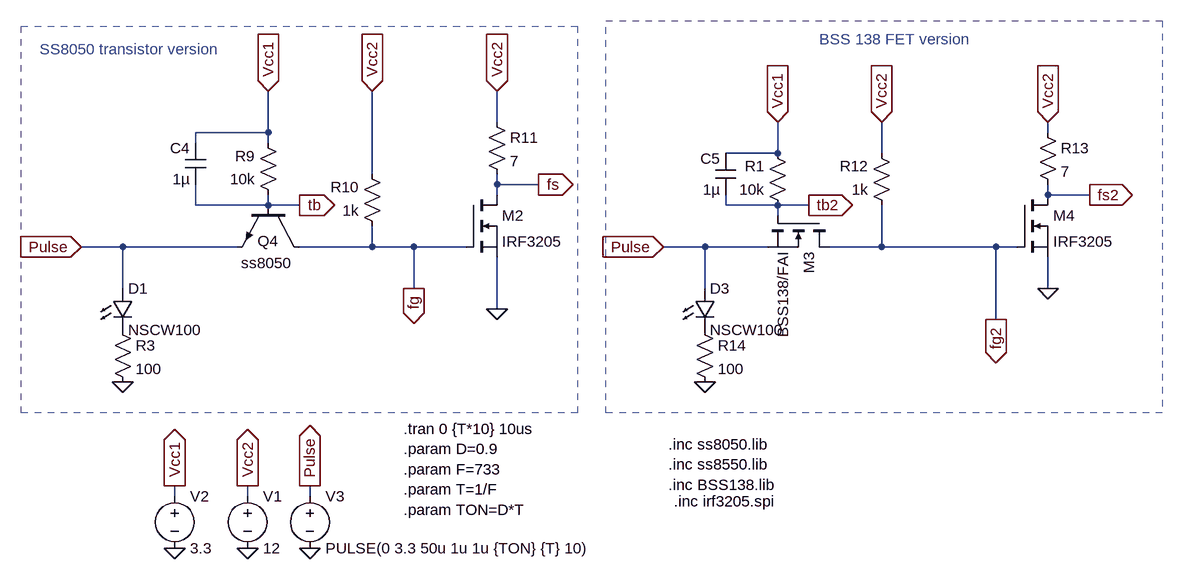
[diagram p0: schematic Tire Warmer.asc]
Tire Warmer.asc, the LTspice schematic file:
Version 4
SHEET 1 1844 824
WIRE 656 48 656 0
WIRE 304 64 304 0
WIRE 304 64 192 64
WIRE 1504 64 1504 48
WIRE 192 80 192 64
WIRE 304 80 304 64
WIRE 1088 96 1088 48
WIRE 1088 96 1008 96
WIRE 1248 96 1248 48
WIRE 464 128 464 0
WIRE 656 144 656 128
WIRE 720 144 656 144
WIRE 656 160 656 144
WIRE 1504 160 1504 144
WIRE 1568 160 1504 160
WIRE 192 176 192 144
WIRE 304 176 304 160
WIRE 304 176 192 176
WIRE 352 176 304 176
WIRE 1008 176 1008 160
WIRE 1088 176 1008 176
WIRE 1136 176 1088 176
WIRE 1088 192 1088 176
WIRE 80 240 16 240
WIRE 256 240 80 240
WIRE 464 240 464 208
WIRE 464 240 352 240
WIRE 528 240 464 240
WIRE 608 240 528 240
WIRE 976 240 912 240
WIRE 1072 240 976 240
WIRE 1248 240 1248 176
WIRE 1248 240 1168 240
WIRE 1424 240 1248 240
WIRE 1456 240 1424 240
WIRE 80 304 80 240
WIRE 528 304 528 240
WIRE 976 304 976 240
WIRE 1504 304 1504 256
WIRE 656 336 656 256
WIRE 1424 352 1424 240
WIRE 160 624 160 608
WIRE 272 624 272 608
WIRE 368 624 368 608
FLAG 272 704 0
FLAG 160 704 0
FLAG 272 608 Vcc2
IOPIN 272 608 Out
FLAG 160 608 Vcc1
IOPIN 160 608 Out
FLAG 368 608 Pulse
IOPIN 368 608 Out
FLAG 16 240 Pulse
IOPIN 16 240 In
FLAG 368 704 0
FLAG 304 0 Vcc1
IOPIN 304 0 In
FLAG 464 0 Vcc2
IOPIN 464 0 In
FLAG 656 0 Vcc2
IOPIN 656 0 In
FLAG 720 144 fs
IOPIN 720 144 Out
FLAG 656 336 0
FLAG 528 304 fg
IOPIN 528 304 Out
FLAG 1088 48 Vcc1
IOPIN 1088 48 In
FLAG 1248 48 Vcc2
IOPIN 1248 48 In
FLAG 1424 352 fg2
IOPIN 1424 352 Out
FLAG 1504 48 Vcc2
IOPIN 1504 48 In
FLAG 1504 304 0
FLAG 1568 160 fs2
IOPIN 1568 160 Out
FLAG 352 176 tb
IOPIN 352 176 Out
FLAG 80 448 0
FLAG 912 240 Pulse
IOPIN 912 240 In
FLAG 976 448 0
FLAG 1136 176 tb2
IOPIN 1136 176 Out
SYMBOL voltage 272 608 R0
SYMATTR InstName V1
SYMATTR Value 12
SYMBOL voltage 160 608 R0
SYMATTR InstName V2
SYMATTR Value 3.3
SYMBOL voltage 368 608 R0
SYMATTR InstName V3
SYMATTR Value PULSE(0 3.3 50u 1u 1u {TON} {T} 10)
SYMBOL LED 64 304 R0
SYMATTR InstName D1
SYMATTR Value NSCW100
SYMBOL res 64 352 R0
SYMATTR InstName R3
SYMATTR Value 100
SYMBOL npn 352 176 R90
WINDOW 0 55 32 VRight 2
WINDOW 3 89 12 VRight 2
SYMATTR InstName Q4
SYMATTR Value ss8050
SYMBOL res 320 176 R180
WINDOW 0 36 76 Left 2
WINDOW 3 36 40 Left 2
SYMATTR InstName R9
SYMATTR Value 10k
SYMBOL res 480 224 R180
WINDOW 0 36 76 Left 2
WINDOW 3 36 40 Left 2
SYMATTR InstName R10
SYMATTR Value 1k
SYMBOL nmos 608 160 R0
SYMATTR InstName M2
SYMATTR Value IRF3205
SYMATTR Prefix x
SYMBOL res 640 32 R0
SYMATTR InstName R11
SYMATTR Value 7
SYMBOL cap 208 144 R180
WINDOW 0 24 56 Left 2
WINDOW 3 24 8 Left 2
SYMATTR InstName C4
SYMATTR Value 1µ
SYMBOL nmos 1168 192 R90
SYMATTR InstName M3
SYMATTR Value BSS138/FAI
SYMATTR Prefix X
SYMBOL res 1104 192 R180
WINDOW 0 36 76 Left 2
WINDOW 3 36 40 Left 2
SYMATTR InstName R1
SYMATTR Value 10k
SYMBOL res 1264 192 R180
WINDOW 0 36 76 Left 2
WINDOW 3 36 40 Left 2
SYMATTR InstName R12
SYMATTR Value 1k
SYMBOL nmos 1456 160 R0
SYMATTR InstName M4
SYMATTR Value IRF3205
SYMATTR Prefix x
SYMBOL res 1488 48 R0
SYMATTR InstName R13
SYMATTR Value 7
SYMBOL LED 960 304 R0
SYMATTR InstName D3
SYMATTR Value NSCW100
SYMBOL res 960 352 R0
SYMATTR InstName R14
SYMATTR Value 100
SYMBOL cap 1024 160 R180
WINDOW 0 24 56 Left 2
WINDOW 3 24 8 Left 2
SYMATTR InstName C5
SYMATTR Value 1µ
TEXT 512 520 Left 2 !.tran 0 {T*10} 10us\n.param D=0.9\n.param F=733\n.param T=1/F\n.param TON=D*T
TEXT 928 632 Left 2 !.inc irf3205.spi
TEXT 920 544 Left 2 !.inc ss8050.lib\n.inc ss8550.lib\n.inc BSS138.lib
TEXT 1152 -80 Left 2 ;BSS 138 FET version
TEXT -48 -64 Left 2 ;SS8050 transistor version
RECTANGLE Normal 824 -108 1680 496 2
RECTANGLE Normal 780 496 -76 -100 2

The netlist it stands for:
* Tire Warmer.asc
V1 Vcc2 0 12
V2 Vcc1 0 3.3
V3 Pulse 0 PULSE(0 3.3 50u 1u 1u {TON} {T} 10)
D1 Pulse P001 NSCW100
R3 P001 0 100
Q4 fg tb Pulse 0 ss8050
R9 tb Vcc1 10k
R10 fg Vcc2 1k
XM2 fs fg 0 IRF3205  ; pins D G S
R11 Vcc2 fs 7
C4 tb Vcc1 1µ
XM3 fg2 tb2 Pulse BSS138/FAI  ; pins D G S
R1 tb2 Vcc1 10k
R12 fg2 Vcc2 1k
XM4 fs2 fg2 0 IRF3205  ; pins D G S
R13 Vcc2 fs2 7
D3 Pulse P002 NSCW100
R14 P002 0 100
C5 tb2 Vcc1 1µ
.model D D
.lib standard.dio
.model NPN NPN
.model PNP PNP
.lib standard.bjt
.tran 0 {T*10} 10us
.param D=0.9
.param F=733
.param T=1/F
.param TON=D*T
.inc irf3205.spi
.inc ss8050.lib
.inc ss8550.lib
.inc BSS138.lib
* BSS 138 FET version
* SS8050 transistor version
.backanno
.end